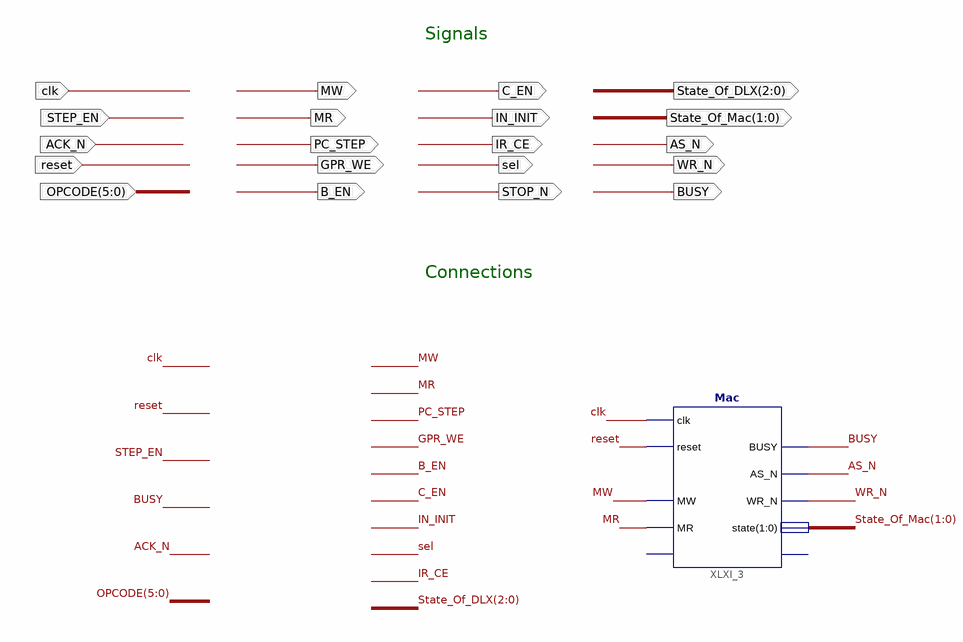
[diagram p0: schematic sheet 1]
// Xilinx ISE schematic DLX_LS.sch (spartan6) as structural Verilog: 1 symbols, 20 ports
module DLX_LS (
  input  STEP_EN,
  input  [5:0] OPCODE,
  input  reset,
  input  ACK_N,
  input  clk,
  output PC_STEP,
  output GPR_WE,
  output B_EN,
  output STOP_N,
  output [2:0] State_Of_DLX,
  output [1:0] State_Of_Mac,
  output BUSY,
  output MW,
  output MR,
  output C_EN,
  output IN_INIT,
  output sel,
  output IR_CE,
  output AS_N,
  output WR_N
);

  Mac XLXI_3 (
    .clk(clk), .reset(reset), .MW(MW), .MR(MR), .BUSY(BUSY), .AS_N(AS_N), .WR_N(WR_N), .state(State_Of_Mac));  // open: ACK, REQ

  // Notes on the sheet:
  //   Signals
  //   Connections
endmodule
